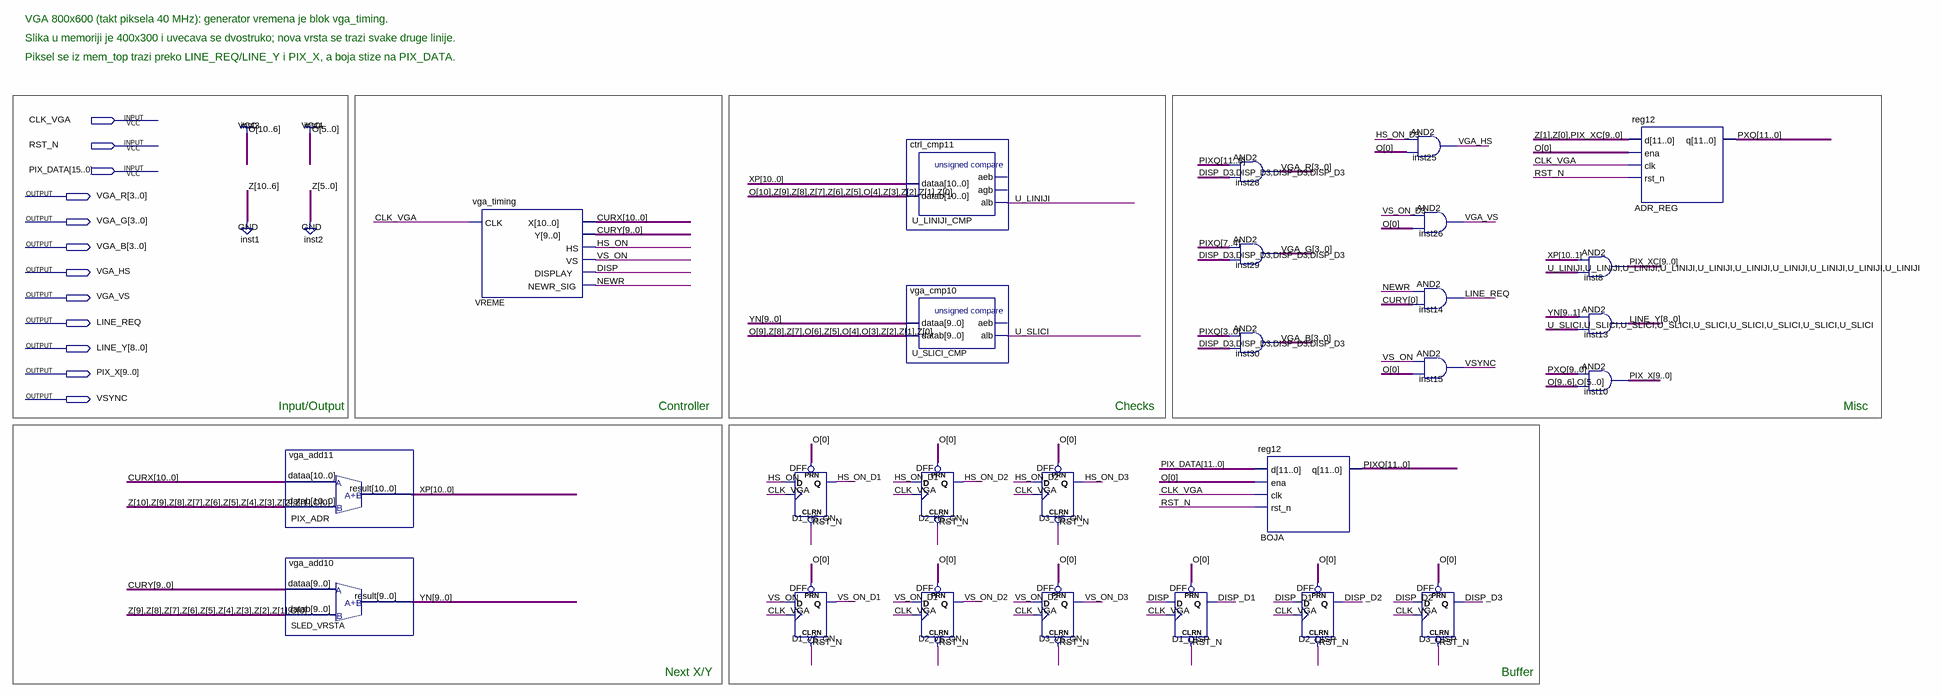
[diagram p0: schematic sheet]
// Quartus schematic vga.bdf as structural Verilog: 26 symbols, 12 pins
module vga (
  input  CLK_VGA,
  input  RST_N,
  input  [15:0] PIX_DATA,
  output [3:0] VGA_R,
  output [3:0] VGA_G,
  output [3:0] VGA_B,
  output VGA_HS,
  output VGA_VS,
  output LINE_REQ,
  output [8:0] LINE_Y,
  output [9:0] PIX_X,
  output VSYNC
);

  wire DISP, DISP_D1, DISP_D2, DISP_D3, HS_ON, HS_ON_D1, HS_ON_D2, HS_ON_D3, NEWR, U_LINIJI, U_SLICI, VS_ON,
       VS_ON_D1, VS_ON_D2, VS_ON_D3;
  wire [9:0] CURY, PIX_XC, YN;
  wire [10:0] CURX, XP;
  wire [11:0] PIXQ, PXQ;

  vga_add11 PIX_ADR (.dataa(CURX), .datab(11'b00000000001), .result(XP));
  vga_add10 SLED_VRSTA (.dataa(CURY), .datab(10'b0000000001), .result(YN));
  vga_timing VREME (.CLK(CLK_VGA), .X(CURX), .Y(CURY), .HS(HS_ON), .VS(VS_ON), .DISPLAY(DISP), .NEWR_SIG(NEWR));
  DFF D1_HS_ON (.CLRN(RST_N), .CLK(CLK_VGA), .D(HS_ON), .PRN(1'b1), .Q(HS_ON_D1));
  DFF D1_VS_ON (.CLRN(RST_N), .CLK(CLK_VGA), .D(VS_ON), .PRN(1'b1), .Q(VS_ON_D1));
  ctrl_cmp11 U_LINIJI_CMP (.dataa(XP), .datab(11'b10000010000), .alb(U_LINIJI));  // open: aeb, agb
  vga_cmp10 U_SLICI_CMP (.dataa(YN), .datab(10'b1001011000), .alb(U_SLICI));  // open: aeb
  DFF D2_HS_ON (.CLRN(RST_N), .CLK(CLK_VGA), .D(HS_ON_D1), .PRN(1'b1), .Q(HS_ON_D2));
  DFF D2_VS_ON (.CLRN(RST_N), .CLK(CLK_VGA), .D(VS_ON_D1), .PRN(1'b1), .Q(VS_ON_D2));
  DFF D3_HS_ON (.CLRN(RST_N), .CLK(CLK_VGA), .D(HS_ON_D2), .PRN(1'b1), .Q(HS_ON_D3));
  DFF D3_VS_ON (.CLRN(RST_N), .CLK(CLK_VGA), .D(VS_ON_D2), .PRN(1'b1), .Q(VS_ON_D3));
  DFF D1_DISP (.CLRN(RST_N), .CLK(CLK_VGA), .D(DISP), .PRN(1'b1), .Q(DISP_D1));
  assign VGA_R = PIXQ[11:8] & {4{DISP_D3}};  // AND2 inst28, 4 bits wide
  assign VGA_G = PIXQ[7:4] & {4{DISP_D3}};  // AND2 inst29, 4 bits wide
  assign VGA_B = PIXQ[3:0] & {4{DISP_D3}};  // AND2 inst30, 4 bits wide
  reg12 BOJA (.d(PIX_DATA[11:0]), .ena(1'b1), .clk(CLK_VGA), .rst_n(RST_N), .q(PIXQ));
  DFF D2_DISP (.CLRN(RST_N), .CLK(CLK_VGA), .D(DISP_D1), .PRN(1'b1), .Q(DISP_D2));
  and inst25 (VGA_HS, HS_ON_D3, 1'b1);
  and inst26 (VGA_VS, VS_ON_D3, 1'b1);
  and inst14 (LINE_REQ, NEWR, CURY[0]);
  and inst15 (VSYNC, VS_ON, 1'b1);
  DFF D3_DISP (.CLRN(RST_N), .CLK(CLK_VGA), .D(DISP_D2), .PRN(1'b1), .Q(DISP_D3));
  assign PIX_XC = XP[10:1] & {10{U_LINIJI}};  // AND2 inst8, 10 bits wide
  assign LINE_Y = YN[9:1] & {9{U_SLICI}};  // AND2 inst13, 9 bits wide
  assign PIX_X = PXQ[9:0] & {10{1'b1}};  // AND2 inst10, 10 bits wide
  reg12 ADR_REG (.d({2'b00, PIX_XC}), .ena(1'b1), .clk(CLK_VGA), .rst_n(RST_N), .q(PXQ));

  // Notes on the sheet:
  //   VGA 800x600 (takt piksela 40 MHz): generator vremena je blok vga_timing.
  //   Slika u memoriji je 400x300 i uvecava se dvostruko; nova vrsta se trazi svake druge linije.
  //   Piksel se iz mem_top trazi preko LINE_REQ/LINE_Y i PIX_X, a boja stize na PIX_DATA.
  //   Input/Output
  //   Controller
  //   Checks
  //   Misc
  //   Next X/Y
  //   Buffer
endmodule
